# EAGLE schematic PowerResetBrd (EAGLE 6.5.0)
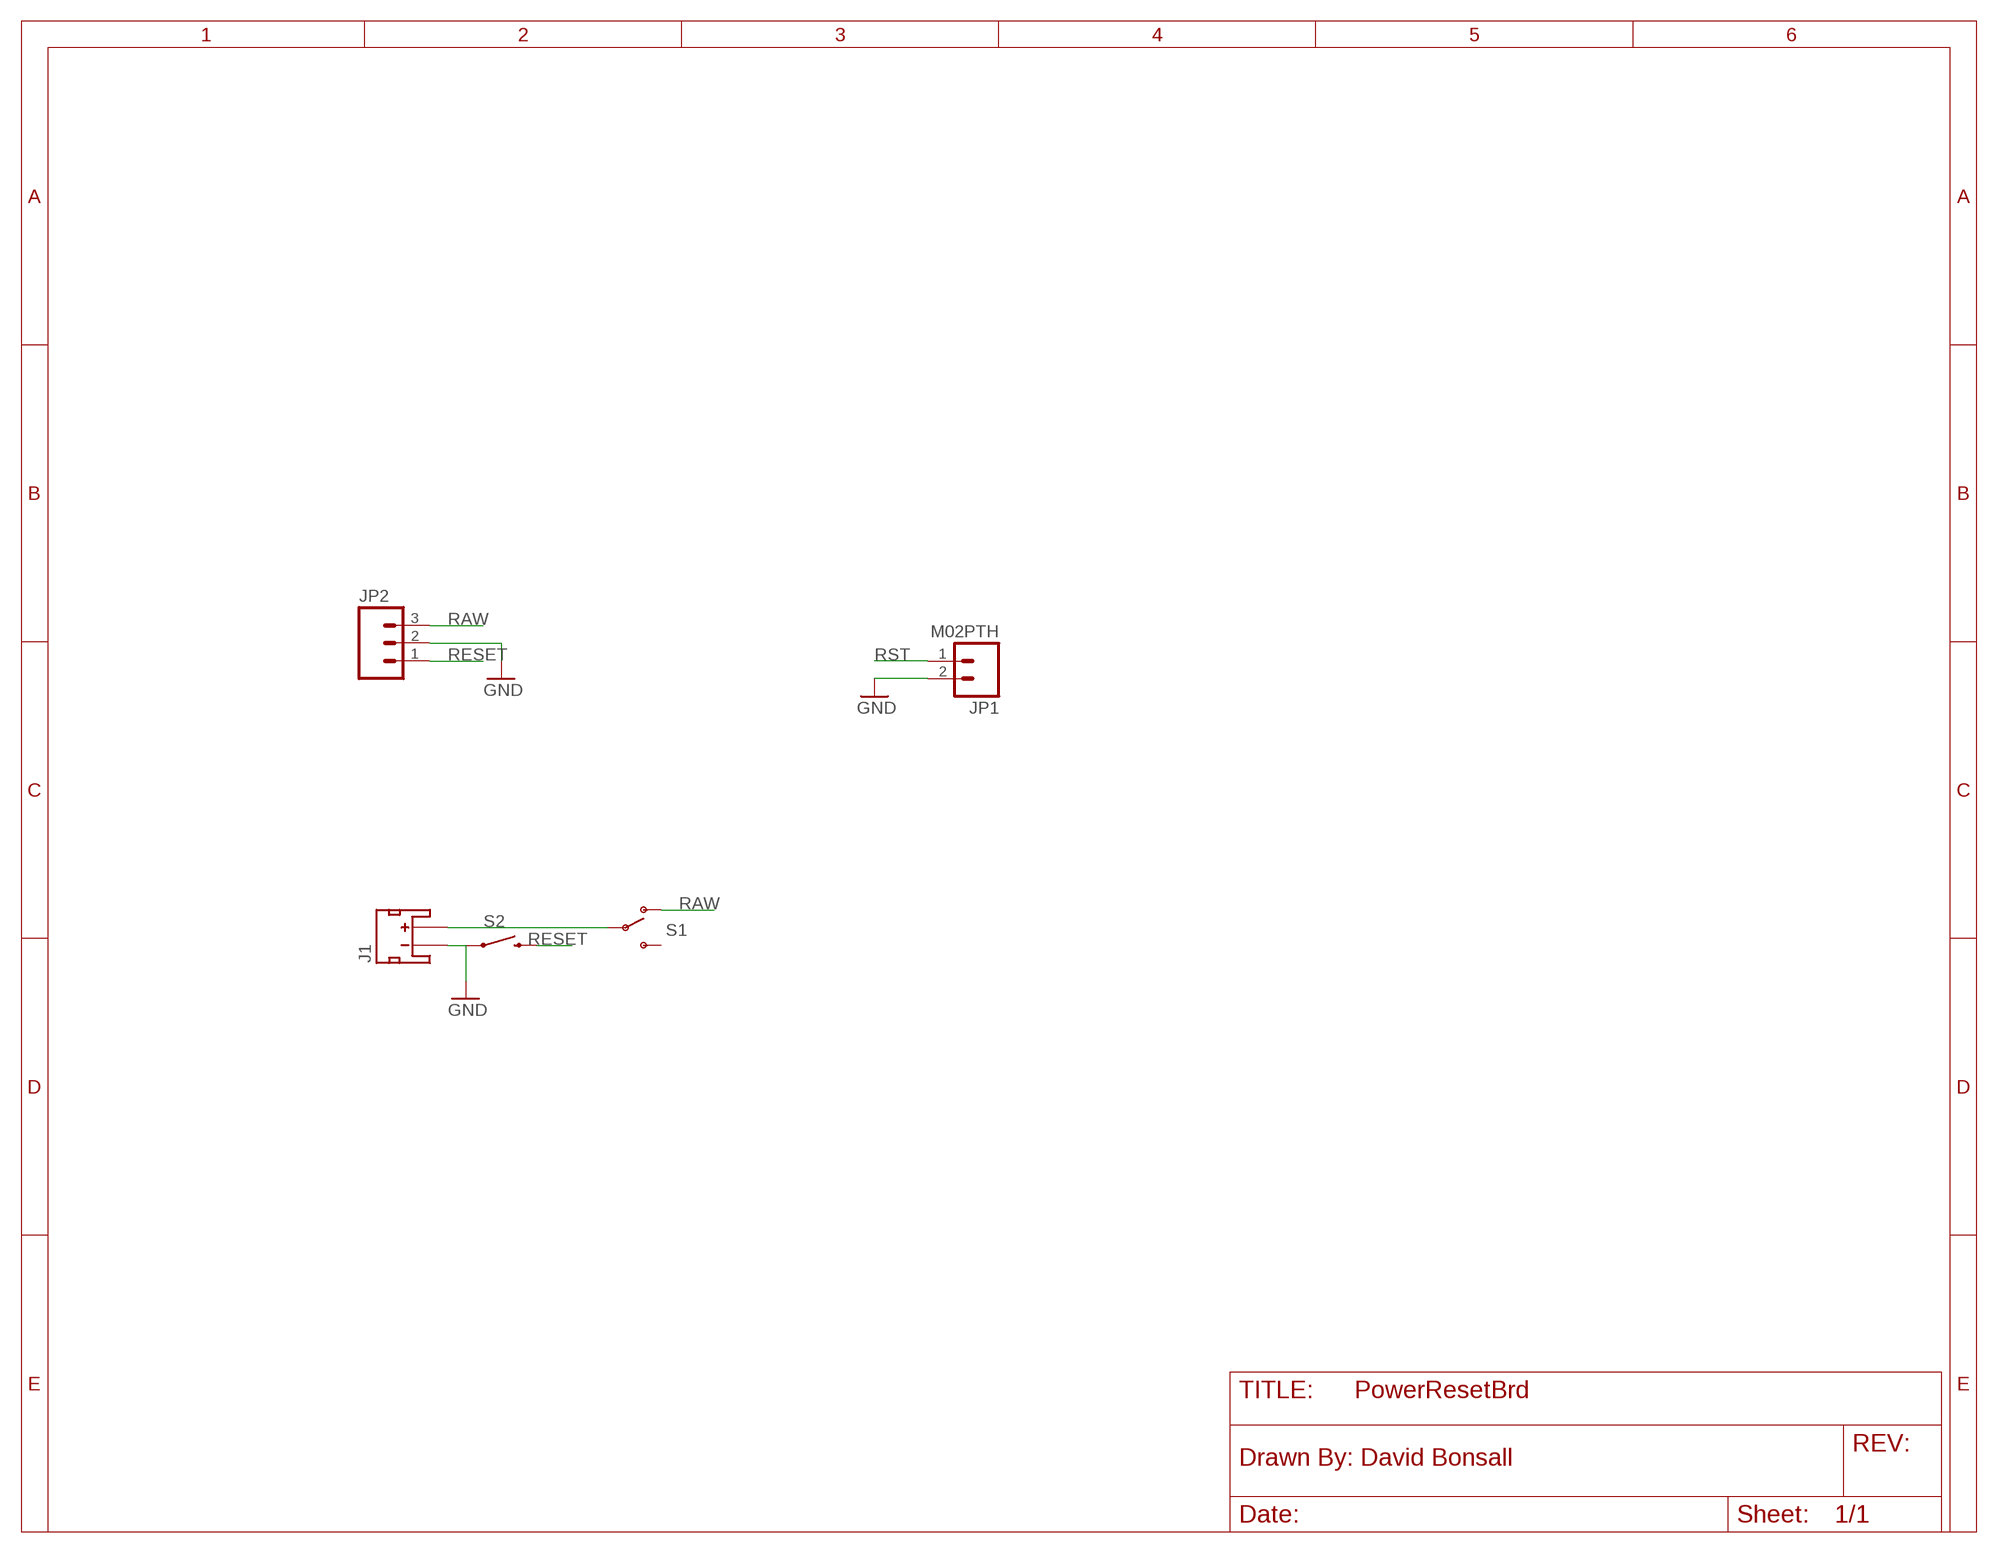
[diagram p0: schematic, sheet 1]

## Parts
J1  JST_2MM_MALE  [JST-2-SMD]
JP1  M02PTH  [1X02]
JP2  M03PTH  [1X03]
S1  SWITCH-SPDTPTH  [SWITCH-SPDT]
S2  SWITCH-MOMENTARY-2PTH  [TACTILE-PTH]

## Nets
GND: J1.1(-) JP1.2 JP2.2 S2.1
N$1: J1.2(+) S1.2(P)
RAW: JP2.3 S1.1(O)
RESET: JP2.1 S2.3
RST: JP1.1
Unconnected: J1.NC1(PAD1) J1.NC2(PAD2) S1.3(S)

## Library data of the parts
J1 = SparkFun-Connectors:JST_2MM_MALE: Mates to single-cell LiPo batteries. CONN-08352; PROD_ID: CONN-08352
JP1 = SparkFun-Connectors:M02: Standard 2-pin 0.1" header. Use with - straight break away headers ( PRT-00116) - right angle break away headers (PRT-00553) - swiss pins (PRT-00743) - machine pins (PRT-00117) - female headers (PRT-00115) Molex polarized connector foot print use with: PRT-08233 with associated crimp pins and housings. 2.54_SCREWTERM for use with PRT-10571. 3.5mm Screw Terminal footprints for PRT-08084 5mm Screw Terminal footprints for use with PRT-08433
JP2 = SparkFun-Connectors:M03: Header 3 Standard 3-pin 0.1" header. Use with straight break away headers (SKU : PRT-00116), right angle break away headers (PRT-00553), swiss pins (PRT-00743), machine pins (PRT-00117), and female headers (PRT-00115). Molex polarized connector foot print use with SKU : PRT-08232 with associated crimp pins and housings.
S1 = SparkFun-Electromechanical:SWITCH-SPDT: SPDT Switch Simple slide switch, Spark Fun Electronics SKU : COM-00102 DPDT SMT slide switch, AYZ0202, SWCH-08179
S2 = SparkFun-Electromechanical:SWITCH-MOMENTARY-2: Various NO switches- pushbuttons, reed, etc